# Altium project Flight_Computer_1.PrjPcb (part 2 of 2)

## Sheet Power.SchDoc
size B; SheetNumber: 4; SheetTotal: 7
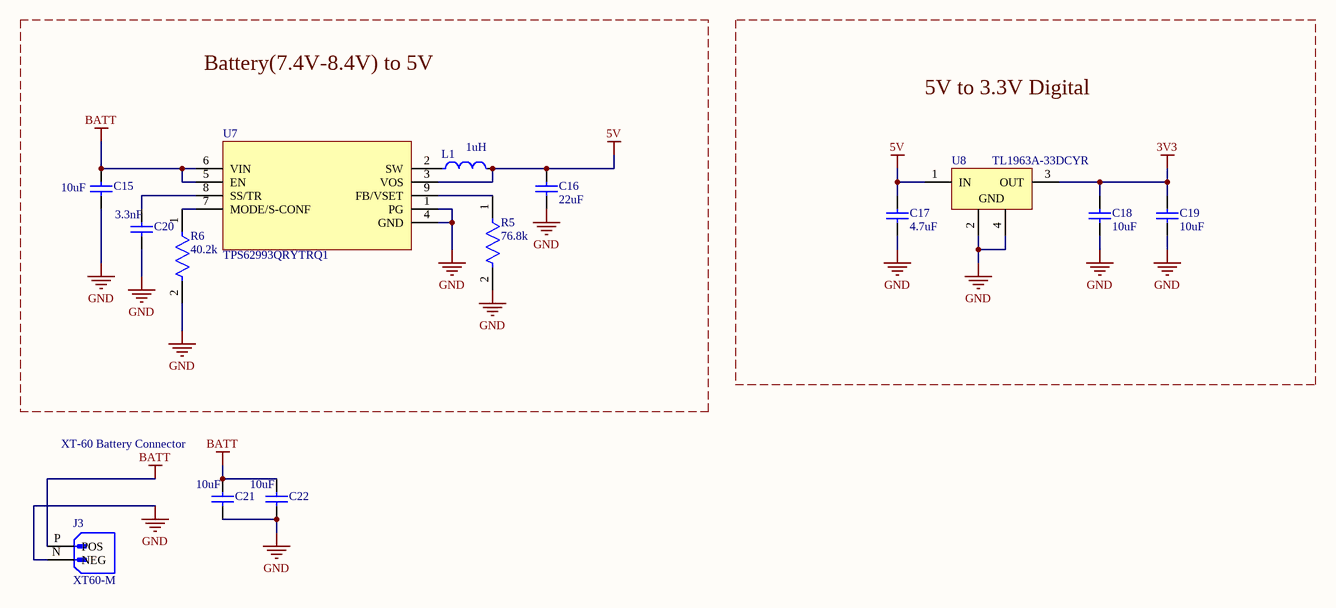
[diagram p1: Power.SchDoc]

### Parts
C15  10uF  [0402_C]
C16  22uF  [0402_C]
C17  4.7uF  [0402_C]
C18  10uF  [0402_C]
C19  10uF  [0402_C]
C20  3.3nF  [0402_C]
C21  10uF  [0402_C]
C22  10uF  [0402_C]
J3  XT60-M  [AMASS_XT60-M]
L1  1uH  [AOTAB201610S3R3101T]
R5  76.8k  [FP-RK73H1J-MFG]
R6  40.2k  [FP-RK73H1J-MFG]
U7  TPS62993QRYTRQ1  [RYT0009A-MFG]
U8  TL1963A-33DCYR  [SOT230P700X180-4N]

### Blocks framed on the sheet
Battery(7.4V-8.4V) to 5V: C15 C16 C20 L1 R5 R6 U7
5V to 3.3V Digital: C17-C19 U8

### Nets
3V3: C18.2 C19.2 U8.3(OUT)
5V: C16.2 C17.1 L1.2 U7.3(VOS) U8.1(IN)
BATT: C15.1 C21.1 C22.1 J3.P(POS) U7.5(EN) U7.6(VIN)
GND: C15.2 C16.1 C17.2 C18.1 C19.1 C20.1 C21.2 C22.2 J3.N(NEG) R5.2 R6.2 U7.1(PG) U7.4(GND) U8.2(GND) U8.4(GND)
NetC20_2: C20.2 U7.8(SS/TR)
NetL1_1: L1.1 U7.2(SW)
NetR5_1: R5.1 U7.9(FB/VSET)
NetR6_1: R6.1 U7.7(MODE/S-CONF)

### Notes on the sheet
- (near C21) XT-60 Battery Connector

### Library data of the parts
C15 C18 C19 C21 C22 = C_10uF_0402: Ceramic Capacitor, Multilayer, Ceramic, 10V, 20% +Tol, 20% -Tol, X5R, +-15% TC, 10uF, Surface Mount, 0402 inch; Manufacturer: Samsung Electro-Mechanics; Manufacturer Part Number: CL05A106MP5NUNC; Value: 10µF; LCSC Part #: C315248; Supplier: DigiKey; Supplier Part Number: 1276-1450-1-ND; RoHS: Compliant; Category: Ceramic Capacitors; Stock: 1973072; Pricing: 1=0.08, 10=0.038, 50=0.034, 100=0.0296, 500=0.0272, 1000=0.02, 2500=0.01844 (USD); Case/Package: 0402; Case Code (Imperial): 0402; Case Code (Metric): 1005; China RoHS: Compliant; Contact Plating: Tin; Depth: 500µm; Dielectric: X5R; Dielectric Material: Ceramic; Height: 700µm; Lead Free: Lead Free; Length: 1mm; Lifecycle Status: NRND; Material: Ceramic; Max Operating Temperature: 85°C; Min Operating Temperature: -55°C; Mounting Technology: Surface Mount; Number of Terminals: 2; Packaging: Tape and Reel; Radiation Hardening: No; REACH SVHC: Yes; Schedule B: 8532240020, 8532240020|8532240020|8532240020|8532240020|8532240020|8532240020|8532240020|8532240020|8532240020|8532240020|8532240020|8532240020|8532240020|8532240020|8532240020|8532240020|8532240020|8532240020|8532240020|8532240020|8532240020|8532240020|8532240020|85; Termination: Wraparound; Thickness: 711.2µm; Tolerance: 20%; Voltage Rating: 10V; Voltage Rating (DC): 10V; Width: 500µm; ComponentLink1URL: https://datasheet.octopart.com:443/CL05A106MP5NUNC-Samsung-Electro-Mechanics-datasheet-182018593.pdf?src-supplier=IHS; ComponentLink1Description: https://datasheet.octopart.com:443/CL05A106MP5NUNC-Samsung-Electro-Mechanics-datasheet-182018593.pdf?src-supplier=IHS; ComponentLink2URL: https://datasheet.octopart.com:443/CL05A106MP5NUNC-Samsung-Electro-Mechanics-datasheet-136031723.pdf?src-supplier=Upverter; ComponentLink2Description: https://datasheet.octopart.com:443/CL05A106MP5NUNC-Samsung-Electro-Mechanics-datasheet-136031723.pdf?src-supplier=Upverter; ComponentLink3URL: https://datasheet.octopart.com:443/CL05A106MP5NUNC-Samsung-Electro-Mechanics-datasheet-110226206.pdf?src-supplier=Future+Electronics; ComponentLink3Description: https://datasheet.octopart.com:443/CL05A106MP5NUNC-Samsung-Electro-Mechanics-datasheet-110226206.pdf?src-supplier=Future+Electronics; ComponentLink4URL: https://datasheet.octopart.com:443/CL05A106MP5NUNC-Samsung-Electro-Mechanics-datasheet-87580039.pdf?src-supplier=Future+Electronics; ComponentLink4Description: https://datasheet.octopart.com:443/CL05A106MP5NUNC-Samsung-Electro-Mechanics-datasheet-87580039.pdf?src-supplier=Future+Electronics; ComponentLink5URL: https://datasheet.octopart.com:443/CL05A106MP5NUNC-Samsung-Electro-Mechanics-datasheet-81461595.pdf?src-supplier=Future+Electronics; ComponentLink5Description: https://datasheet.octopart.com:443/CL05A106MP5NUNC-Samsung-Electro-Mechanics-datasheet-81461595.pdf?src-supplier=Future+Electronics; ComponentLink6URL: https://datasheet.octopart.com:443/CL05A106MP5NUNC-Samsung-datasheet-42280527.pdf?src-supplier=Future+Electronics; ComponentLink6Description: https://datasheet.octopart.com:443/CL05A106MP5NUNC-Samsung-datasheet-42280527.pdf?src-supplier=Future+Electronics; ComponentLink7URL: https://datasheet.octopart.com:443/CL05A106MP5NUNC-Samsung-datasheet-34153002.pdf?src-supplier=Future+Electronics; ComponentLink7Description: https://datasheet.octopart.com:443/CL05A106MP5NUNC-Samsung-datasheet-34153002.pdf?src-supplier=Future+Electronics; ComponentLink8URL: https://datasheet.octopart.com:443/CL05A106MP5NUNC-Samsung-datasheet-25077983.pdf?src-supplier=Future+Electronics; ComponentLink8Description: https://datasheet.octopart.com:443/CL05A106MP5NUNC-Samsung-datasheet-25077983.pdf?src-supplier=Future+Electronics; ComponentLink9URL: https://datasheet.octopart.com:443/CL05A106MP5NUNC-Samsung-Electro-Mechanics-datasheet-149136670.pdf?src-supplier=Future+Electronics; ComponentLink9Description: https://datasheet.octopart.com:443/CL05A106MP5NUNC-Samsung-Electro-Mechanics-datasheet-149136670.pdf?src-supplier=Future+Electronics; ComponentLink10URL: https://datasheet.octopart.com:443/CL05A106MP5NUNC-Samsung-datasheet-8326407.pdf?src-supplier=TME; ComponentLink10Description: https://datasheet.octopart.com:443/CL05A106MP5NUNC-Samsung-datasheet-8326407.pdf?src-supplier=TME
C16 = C_22uF_0402_1: CAP CER 22UF 10V X5R 0402; Manufacturer: Murata; Manufacturer Part Number: GRM158R61A226ME15D; Manufacturer Lifecycle Status: IN PRODUCTION; Value: 22µF; Dielectric Material: Ceramic; Tolerance: 20%; Supplier: DigiKey; Supplier Part Number: 490-GRM158R61A226ME15DCT-ND; RoHS: Compliant; Category: Ceramic Capacitors; Stock: 154156; Pricing: 1=0.41, 10=0.247, 50=0.1828, 100=0.1632, 500=0.1301, 1000=0.1199, 2500=0.10912, 8000=0.09979, 16000=0.09611, 24000=0.09372, 40000=0.09107, 56000=0.09089, 80000=0.08732 (USD); Case/Package: 0402; Dielectric: X5R; Height: 800µm; Length: 1mm; Lifecycle Status: Production; Material: Ceramic; Max Operating Temperature: 85°C; Min Operating Temperature: -55°C; Mounting Technology: Surface Mount; Number of Terminals: 2; REACH SVHC: Yes; Thickness: 800µm; Voltage Rating: 10V; Voltage Rating (DC): 10V; Width: 500µm; ComponentLink1URL: https://datasheet.octopart.com:443/GRM158R61A226ME15D-Murata-datasheet-165579666.pdf?src-supplier=TME; ComponentLink1Description: https://datasheet.octopart.com:443/GRM158R61A226ME15D-Murata-datasheet-165579666.pdf?src-supplier=TME; ComponentLink2URL: https://datasheet.octopart.com/GRM158R61A226ME15D-Murata-datasheet-12515295.pdf; ComponentLink2Description: https://datasheet.octopart.com/GRM158R61A226ME15D-Murata-datasheet-12515295.pdf; ComponentLink3URL: https://datasheet.octopart.com/GRM158R61A226ME15D-Murata-datasheet-12510076.pdf; ComponentLink3Description: https://datasheet.octopart.com/GRM158R61A226ME15D-Murata-datasheet-12510076.pdf; ComponentLink4URL: https://datasheet.octopart.com/GRM158R61A226ME15D-Murata-datasheet-11978611.pdf; ComponentLink4Description: https://datasheet.octopart.com/GRM158R61A226ME15D-Murata-datasheet-11978611.pdf; ComponentLink5URL: https://datasheet.octopart.com/GRM158R61A226ME15D-Murata-datasheet-10025737.pdf; ComponentLink5Description: https://datasheet.octopart.com/GRM158R61A226ME15D-Murata-datasheet-10025737.pdf; ComponentLink6URL: https://datasheet.octopart.com/GRM158R61A226ME15D-Murata-datasheet-8819587.pdf; ComponentLink6Description: https://datasheet.octopart.com/GRM158R61A226ME15D-Murata-datasheet-8819587.pdf; ComponentLink7URL: http://sigma.octopart.com:80/reach_statement/Murata-company-16.pdf?src-supplier=Compliance+Statements; ComponentLink7Description: http://sigma.octopart.com:80/reach_statement/Murata-company-16.pdf?src-supplier=Compliance+Statements; LCSC Part #: C3845593
C17 = C_4.7uF_0402: CAP CER 4.7UF 16V X5R 0402; Manufacturer: Samsung; Manufacturer Part Number: CL05A475MO5NUNC; Dielectric Material: Ceramic; Multilayer: Yes; Tolerance  (fill in as +-): 20%; Supplier: Digikey; Supplier Part Number: 1276-6836-1-ND; RoHS: Yes; Category: Ceramic Capacitors; Stock: 200989; Pricing: 1=0.43, 10=0.252, 50=0.1826, 100=0.161, 500=0.12446, 1000=0.11305, 2500=0.10094, 5000=0.0936, 10000=0.08752, 20000=0.08248, 30000=0.07994, 50000=0.07712, 70000=0.07547, 100000=0.07387 (USD); Mounting Technology: Surface Mount; Pins: 2; Package Shape: Rectangular; Case/Package: 0402; Terminal Finish: Nickel; Min Operating Temperature: -55°C; Max Operating Temperature: 85°C; JESD-609 Code: e3; Value: 4.7uF; Capacitor Type: Ceramic; Package Style: SMTMeter; Packaging: Tape and Reel; Tolerance (fill in as +-): 20%; Rated DC Voltage (URdc): 16V; Temperature Characteristics Code: X5R; Termination: Wraparound; Length: 1mm; Width: 0.5mm; Height: 0.7mm; Reach SVHC Compliant: Yes; RoHS Compliant: Yes; ComponentLink1URL: https://datasheet.ciiva.com:443/pdfs/VipMasterIC/IC/SEMS/SEMS-S-A0008384515/SEMS-S-A0008898881-1.pdf?src-supplier=IHS+Markit; ComponentLink1Description: https://datasheet.ciiva.com:443/pdfs/VipMasterIC/IC/SEMS/SEMS-S-A0008384515/SEMS-S-A0008898881-1.pdf?src-supplier=IHS+Markit; ComponentLink2URL: http://www.farnell.com/datasheets/2710653.pdf?src-supplier=Farnell; ComponentLink2Description: http://www.farnell.com/datasheets/2710653.pdf?src-supplier=Farnell; ComponentLink3URL: http://www.samsungsem.com/kr/support/product-search/mlcc/CL05A475MO5NUNC.jsp?src-supplier=Digikey; ComponentLink3Description: http://www.samsungsem.com/kr/support/product-search/mlcc/CL05A475MO5NUNC.jsp?src-supplier=Digikey; ComponentLink4URL: http://www.farnell.com/datasheets/2710653.pdf?src-supplier=Newark; ComponentLink4Description: http://www.farnell.com/datasheets/2710653.pdf?src-supplier=Newark; ComponentLink5URL: http://www.farnell.com/datasheets/2710653.pdf?src-supplier=Element14; ComponentLink5Description: http://www.farnell.com/datasheets/2710653.pdf?src-supplier=Element14; ComponentLink6URL: https://datasheet.octopart.com/CL05A475MO5NUNC-Samsung-Electro-Mechanics-datasheet-123102911.pdf?src-supplier=Future+Electronics; ComponentLink6Description: https://datasheet.octopart.com/CL05A475MO5NUNC-Samsung-Electro-Mechanics-datasheet-123102911.pdf?src-supplier=Future+Electronics; LCSC Part #: C318563
C20 = C_3.3nF_0402: CAP CER 3300PF (3.3nF) 10V X7R 0402; Manufacturer: Samsung Electro-Mechanics; Manufacturer Part Number: CL05B332KA5VPNC; Dielectric Material: Ceramic; Tolerance: 10%; Voltage Rating: 25V; Supplier: DigiKey; Supplier Part Number: 1276-CL05B332KA5VPNCCT-ND; RoHS: Compliant; Category: Ceramic Capacitors; Stock: 24876; Pricing: 1=0.1, 10=0.034, 50=0.0226, 100=0.0193, 500=0.0138, 1000=0.01212, 2500=0.01034, 5000=0.00928 (USD); Value: 3.3nF; Case/Package: 0402; China RoHS: Compliant; Height: 500µm; Length: 1mm; Lifecycle Status: Production; Material: Ceramic; Max Operating Temperature: 125°C; Min Operating Temperature: -55°C; Mounting Technology: Surface Mount; Number of Terminals: 2; REACH SVHC: Yes; Voltage Rating (DC): 25V; Width: 500µm; ComponentLink1URL: https://datasheet.octopart.com:443/CL05B332KA5VPNC-Samsung-Electro-Mechanics-datasheet-176142735.pdf?src-supplier=IHS; ComponentLink1Description: https://datasheet.octopart.com:443/CL05B332KA5VPNC-Samsung-Electro-Mechanics-datasheet-176142735.pdf?src-supplier=IHS; Case Code (Imperial): 0402; Case Code (Metric): 1005; Dielectric: X7R; Pins: 2; Termination: SMD/SMT; Weight: 652.039032µg; ComponentLink2URL: https://datasheet.octopart.com:443/C0402C332M8RACTU-KEMET-datasheet-178445679.pdf?src-supplier=IHS; ComponentLink2Description: https://datasheet.octopart.com:443/C0402C332M8RACTU-KEMET-datasheet-178445679.pdf?src-supplier=IHS; ComponentLink3URL: https://datasheet.octopart.com:443/C0402C332M8RACTU-KEMET-datasheet-137357759.pdf?src-supplier=Upverter; ComponentLink3Description: https://datasheet.octopart.com:443/C0402C332M8RACTU-KEMET-datasheet-137357759.pdf?src-supplier=Upverter; ComponentLink4URL: https://datasheet.octopart.com:443/C0402C332M8RACTU-KEMET-datasheet-157246124.pdf?src-supplier=Electro+Sonic; ComponentLink4Description: https://datasheet.octopart.com:443/C0402C332M8RACTU-KEMET-datasheet-157246124.pdf?src-supplier=Electro+Sonic; ComponentLink5URL: https://datasheet.octopart.com/C0402C332M8RACTU-KEMET-datasheet-84169754.pdf; ComponentLink5Description: https://datasheet.octopart.com/C0402C332M8RACTU-KEMET-datasheet-84169754.pdf; LCSC Part #: C20793063
J3 = CMP-036-000000-1: Plug; DC supply; XT60; male; PIN: 2; for cable; soldered; 30A; 500V; MF: AMASS; Design Item ID: XT60-M; Component Type: Standard; Package: Package; Pin Count: 2; SnapEDA_Link: https://www.snapeda.com/parts/XT60-M/AMASS/view-part/?ref=snap; Value: *; MP: XT60-M; Source: XT60-M.SchLib; Check_prices: https://www.snapeda.com/parts/XT60-M/AMASS/view-part/?ref=eda
L1 = L_1uH_2016: FIXED IND 1UH 1.7A 128 MOHM SMD; Manufacturer: Murata; Manufacturer Part Number: DFE201610E-2R2M=P2; Manufacturer Lifecycle Status: IN PRODUCTION; DC Resistance (DCR): 140mΩ; Value: 2.2µH; Inductance Tolerance: 20%; Number of Circuits: 1; Saturation Current: 2.4A; Shielding: Yes; Test Frequency: 1MHz; Core Material: Metal; Supplier: DigiKey; Supplier Part Number: 490-17728-1-ND; RoHS: Compliant; Category: Fixed Inductors; Stock: 158333; Pricing: 1=0.24, 10=0.2, 100=0.1645, 1000=0.13528 (USD); Case/Package: 0806; Composition: Wirewound; Current Rating: 1.7A; Height: 1mm; Lifecycle Status: Production; Max Current Rating: 1.7A; Max Operating Temperature: 125°C; Min Operating Temperature: -40°C; Number of Terminals: 2; Packaging: Cut Tape; REACH SVHC: Yes; RMS Current (Irms): 1.7A; Schedule B: 8504500000; ESR: 140mΩ; Tolerance: 20%; Width: 1.6mm; Ambient Temperature Range High: 85°C; ComponentLink1URL: https://datasheet.octopart.com:443/DFE18SAN1R0MG0L-Murata-datasheet-141261288.pdf?src-supplier=Ciiva; ComponentLink1Description: https://datasheet.octopart.com:443/DFE18SAN1R0MG0L-Murata-datasheet-141261288.pdf?src-supplier=Ciiva; ComponentLink2URL: https://datasheet.octopart.com:443/DFE18SAN1R0MG0L-Murata-datasheet-140650244.pdf?src-supplier=Ciiva; ComponentLink2Description: https://datasheet.octopart.com:443/DFE18SAN1R0MG0L-Murata-datasheet-140650244.pdf?src-supplier=Ciiva; ComponentLink3URL: https://datasheet.octopart.com:443/DFE18SAN1R0MG0L-Murata-datasheet-138707311.pdf?src-supplier=Ciiva; ComponentLink3Description: https://datasheet.octopart.com:443/DFE18SAN1R0MG0L-Murata-datasheet-138707311.pdf?src-supplier=Ciiva; ComponentLink4URL: https://datasheet.octopart.com:443/DFE18SAN1R0MG0L-Murata-datasheet-140568518.pdf?src-supplier=Arrow.cn; ComponentLink4Description: https://datasheet.octopart.com:443/DFE18SAN1R0MG0L-Murata-datasheet-140568518.pdf?src-supplier=Arrow.cn; ComponentLink5URL: https://datasheet.octopart.com:443/DFE18SAN1R0MG0L-Murata-datasheet-169352396.pdf?src-supplier=Arrow.cn; ComponentLink5Description: https://datasheet.octopart.com:443/DFE18SAN1R0MG0L-Murata-datasheet-169352396.pdf?src-supplier=Arrow.cn; ComponentLink6URL: https://datasheet.octopart.com:443/DFE18SAN1R0MG0L-Murata-datasheet-145448863.pdf?src-supplier=Geoflip; ComponentLink6Description: https://datasheet.octopart.com:443/DFE18SAN1R0MG0L-Murata-datasheet-145448863.pdf?src-supplier=Geoflip; ComponentLink7URL: http://sigma.octopart.com:80/reach_statement/Murata-company-16.pdf?src-supplier=Compliance+Statements; ComponentLink7Description: http://sigma.octopart.com:80/reach_statement/Murata-company-16.pdf?src-supplier=Compliance+Statements; LCSC Part #: C560043
R5 R6 = CMP-04015-087673-1: 40.2kΩ ±0.5% 0.1W Chip Resistor 0603 Thick Film AEC-Q200 Qualified / RK73H1JTTD4022D; Resistance: 40.2kR; Temperature Coefficient: 100ppm/°C; Voltage Rating (DC): 50V; Power Rating: 100mW; Length: 1.6mm; Width: 0.8mm; Series: RK73H; Case Code (Imperial): 0603; Min Operating Temperature: -55°C; Height: 0.45mm; Packaging: Tape and Reel; Case/Package: 0603; Max Operating Temperature: 155°C; Tolerance: 0.5%; Voltage Rating: 50V; Package Quantity: 5000; Lead Free: Lead Free; Case Code (Metric): 1608; Termination: SMD/SMT
U7 = TPS62993QRYTRQ1: IC REG BUCK ADJ 3A 9VQFN; Manufacturer: Texas Instruments; Supplier: Digikey; Supplier Part Number: 296-TPS62993QRYTRQ1CT-ND; Manufacturer Part Number: TPS62993QRYTRQ1; RoHS: No; Category: Integrated Circuits (ICs); Stock: 5849; Pricing: 1=1.93, 10=1.418, 25=1.2916, 100=1.1519, 250=1.0854, 500=1.0453, 1000=1.01229 (USD); LCSC Part #: C5342042
U8 = TL1963A-33DCYR: 1.5-A, 20-V, low-dropout voltage regulator with reverse current & reverse voltage protection; Manufacturer_Name: Texas Instruments; Manufacturer Lifecycle Status: ACTIVE; Accuracy: 3%; Dropout Voltage: 340mV; Input Bias Current: 1mA; Max Supply Voltage: 20V; Max Output current: 1.5A; Max Output Voltage: 3.3V; Min Current Limit: 1.6A; Min Input Voltage: 2.1V; Number of Outputs: 1; Output Type: Fixed; Polarity: Positive; Datasheet Link: http://www.ti.com/lit/gpn/tl1963a; Height: 1.8mm; Manufacturer_Part_Number: TL1963A-33DCYR; Mouser Part Number: 595-TL1963A-33DCYR; Mouser Price/Stock: https://www.mouser.co.uk/ProductDetail/Texas-Instruments/TL1963A-33DCYR?qs=IK5e5L0zOXhRu%2FNTAfJNEA%3D%3D; Arrow Part Number: TL1963A-33DCYR; Arrow Price/Stock: https://www.arrow.com/en/products/tl1963a-33dcyr/texas-instruments?utm_currency=USD&region=nac; Supplier: DigiKey; Supplier Part Number: 296-24897-1-ND; Manufacturer: Texas Instruments; Manufacturer Part Number: TL1963A-33DCYR; RoHS: Compliant; Category: LDO Voltage Regulators; Stock: 4355; Pricing: 1=3.13, 10=2.344, 25=2.1476, 100=1.9323, 250=1.82956, 500=1.76766, 1000=1.71669 (USD); Case/Package: SOT-223; Contact Plating: Tin; Lead Free: Lead Free; Length: 6.5mm; Lifecycle Status: Production; Max Operating Temperature: 125°C; Min Operating Temperature: -40°C; Min Output Voltage: 3.3V; Nominal Output Voltage: 3.3V; Pins: 4; Number of Regulators: 1; Output Current: 1.5A; Output Voltage: 3.3V; Quiescent Current: 1mA; Radiation Hardening: No; REACH SVHC: No; Schedule B: 8542390000, 8542390000|8542390000|8542390000|8542390000|8542390000; Thickness: 1.6mm; Width: 3.5mm; ComponentLink1URL: https://datasheet.octopart.com:443/TL1963A-33DCYR-Texas-Instruments-datasheet-36835243.pdf?src-supplier=Texas+Instruments; ComponentLink1Description: https://datasheet.octopart.com:443/TL1963A-33DCYR-Texas-Instruments-datasheet-36835243.pdf?src-supplier=Texas+Instruments; ComponentLink2URL: https://octopart.com:443/opatz8j6/c1?t=3Lun9PgwTMhtjoCtZHlriymffnwWqKd51HlxjKqmfGY6_H2C_KBuCJotYNbhgrmUW1am7v6JdR1BM8r4TVwEJHz6z_rYMi0Qs0z031CNxm_B_9-BYGGxZ_Fe_No2pK5gm8TBALu2o229stvTAGB7nDQj_d6eLc_WleCR5PgeZcoHvq5uYRxI2mhH3aTbYxZvOcpV44gzguOSokgnxqAqTlA2HdDmfd41lcX8KmPOnU485MJM9pETPtWF01ZaQY57NDW7-ROrD2Y9bItpv_3any2aMifmmrhF_toBthhzSyuf2zhFnIbHnl95_iEcXCGpEhG0L2gK6G5uW0d_9rjbvPyTU-a0lHmUSU5HzPKTGuVJR0-dcjYtdbWCQCILPtH1cCuZdAY&src-supplier=Texas+Instruments; ComponentLink2Description: https://octopart.com:443/opatz8j6/c1?t=3Lun9PgwTMhtjoCtZHlriymffnwWqKd51HlxjKqmfGY6_H2C_KBuCJotYNbhgrmUW1am7v6JdR1BM8r4TVwEJHz6z_rYMi0Qs0z031CNxm_B_9-BYGGxZ_Fe_No2pK5gm8TBALu2o229stvTAGB7nDQj_d6eLc_WleCR5PgeZcoHvq5uYRxI2mhH3aTbYxZvOcpV44gzguOSokgnxqAqTlA2HdDmfd41lcX8KmPOnU485MJM9pETPtWF01ZaQY57NDW7-ROrD2Y9bItpv_3any2aMifmmrhF_toBthhzSyuf2zhFnIbHnl95_iEcXCGpEhG0L2gK6G5uW0d_9rjbvPyTU-a0lHmUSU5HzPKTGuVJR0-dcjYtdbWCQCILPtH1cCuZdAY&src-supplier=Texas+Instruments; ComponentLink3URL: https://datasheet.octopart.com:443/TL1963A-33DCYR-Texas-Instruments-datasheet-10255270.pdf?src-supplier=Texas+Instruments; ComponentLink3Description: https://datasheet.octopart.com:443/TL1963A-33DCYR-Texas-Instruments-datasheet-10255270.pdf?src-supplier=Texas+Instruments; ComponentLink4URL: https://sigma.octopart.com:443/49253063/technical_drawing/Texas-Instruments-TL1963A-33DCYR.pdf?src-supplier=Texas+Instruments; ComponentLink4Description: https://sigma.octopart.com:443/49253063/technical_drawing/Texas-Instruments-TL1963A-33DCYR.pdf?src-supplier=Texas+Instruments; ComponentLink5URL: https://datasheet.octopart.com:443/TL1963A-33DCYR-Texas-Instruments-datasheet-159117591.pdf?src-supplier=Augswan; ComponentLink5Description: https://datasheet.octopart.com:443/TL1963A-33DCYR-Texas-Instruments-datasheet-159117591.pdf?src-supplier=Augswan; ComponentLink6URL: https://datasheet.octopart.com:443/TL1963A-33DCYR-Texas-Instruments-datasheet-21820479.pdf?src-supplier=Newark; ComponentLink6Description: https://datasheet.octopart.com:443/TL1963A-33DCYR-Texas-Instruments-datasheet-21820479.pdf?src-supplier=Newark; ComponentLink7URL: https://datasheet.octopart.com:443/TL1963A-33DCYR-Texas-Instruments-datasheet-16079880.pdf?src-supplier=Farnell; ComponentLink7Description: https://datasheet.octopart.com:443/TL1963A-33DCYR-Texas-Instruments-datasheet-16079880.pdf?src-supplier=Farnell; ComponentLink8URL: https://datasheet.octopart.com:443/TL1963A-33DCYR-Texas-Instruments-datasheet-14171511.pdf?src-supplier=iiiC; ComponentLink8Description: https://datasheet.octopart.com:443/TL1963A-33DCYR-Texas-Instruments-datasheet-14171511.pdf?src-supplier=iiiC; ComponentLink9URL: http://sigma.octopart.com:80/conflict_mineral_statement/Texas-Instruments-company-63.pdf?src-supplier=Compliance+Statements; ComponentLink9Description: http://sigma.octopart.com:80/conflict_mineral_statement/Texas-Instruments-company-63.pdf?src-supplier=Compliance+Statements; ComponentLink10URL: http://sigma.octopart.com:80/reach_statement/Texas-Instruments-company-64.pdf?src-supplier=Compliance+Statements; ComponentLink10Description: http://sigma.octopart.com:80/reach_statement/Texas-Instruments-company-64.pdf?src-supplier=Compliance+Statements; LCSC Part #: C181262

## Sheet Connector.SchDoc
size A; SheetNumber: 6; SheetTotal: 7
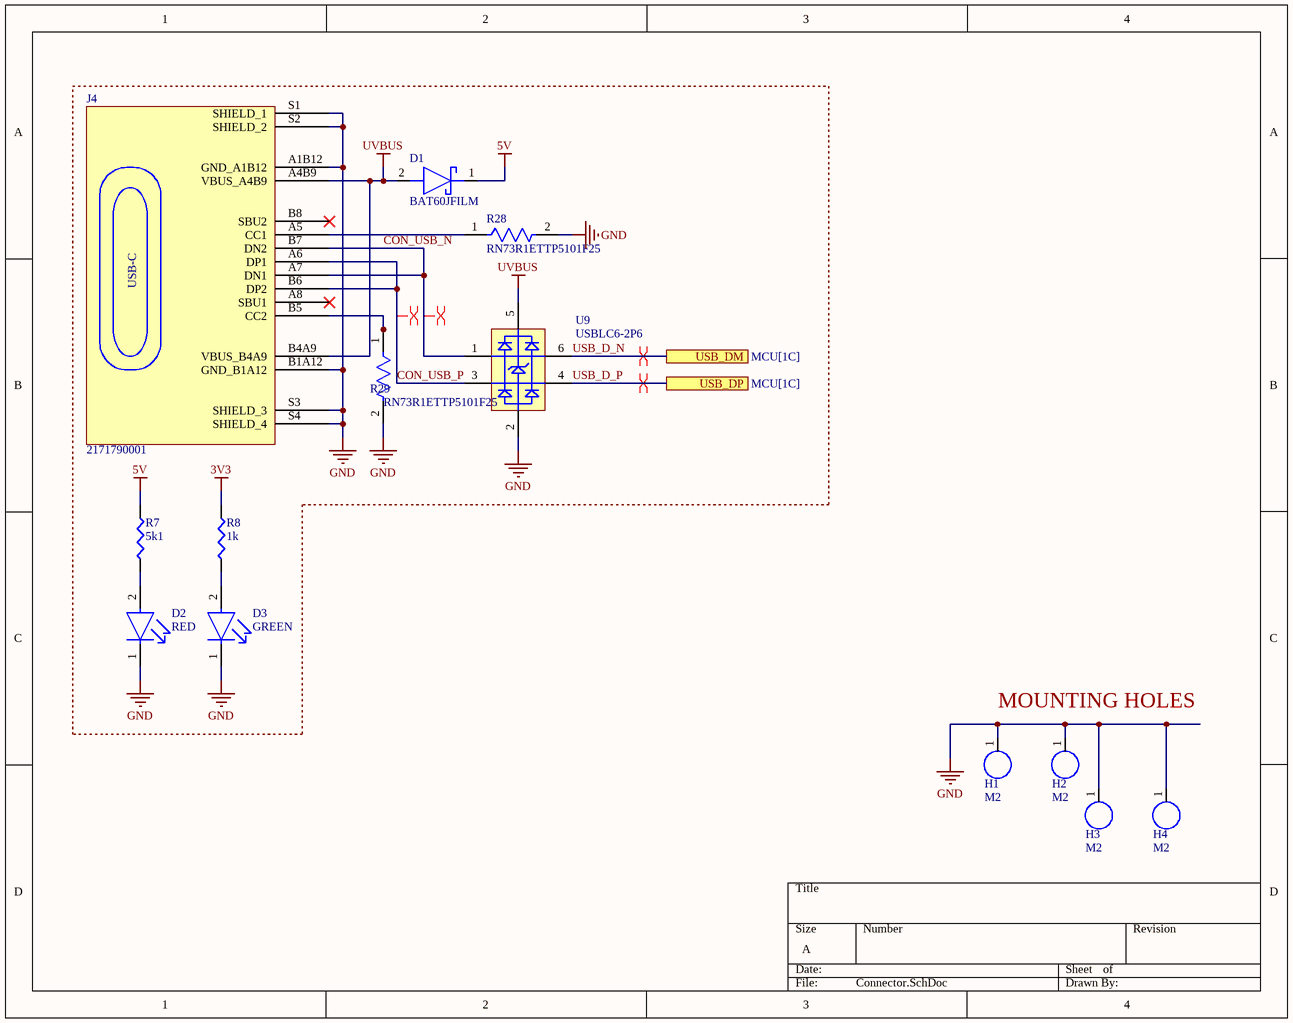
[diagram p2: Connector.SchDoc]

### Parts
D1  BAT60JFILM  [SOD2513X117N]
D2  RED  [LEDC1005X35N]
D3  GREEN  [LEDC1005X35N]
H1  M2  [Mounting Hole]
H2  M2  [Mounting Hole]
H3  M2  [Mounting Hole]
H4  M2  [Mounting Hole]
J4  2171790001  [FP-2171790001-MFG]
R7  5k1  [0402_R]
R8  1k  [0402_R]
R28  RN73R1ETTP5101F25  [FP-RN73R1E-IPC_C]
R29  RN73R1ETTP5101F25  [FP-RN73R1E-IPC_C]
U9  USBLC6-2P6  [USBLC62P6]

### Ports
USB_DM (see MCU[1C]), USB_DP (see MCU[1C])

### Nets
3V3: R8.2
5V: D1.1(K) R7.2
GND: D2.1(C) D3.1(C) H1.1 H2.1 H3.1 H4.1 J4.A1B12(GND_A1B12) J4.B1A12(GND_B1A12) J4.S1(SHIELD_1) J4.S2(SHIELD_2) J4.S3(SHIELD_3) J4.S4(SHIELD_4) R28.2 R29.2 U9.2(GND)
UVBUS: D1.2(A) J4.A4B9(VBUS_A4B9) J4.B4A9(VBUS_B4A9) U9.5(VBUS)
CON_USB_N: J4.A7(DN1) J4.B7(DN2) U9.1(I/O1_1)
CON_USB_P: J4.A6(DP1) J4.B6(DP2) U9.3(I/O2_1)
USB_D_N: U9.6(I/O1_2) ; port USB_DM
USB_D_P: U9.4(I/O2_2) ; port USB_DP
NetD2_2: D2.2(A) R7.1
NetD3_2: D3.2(A) R8.1
NetJ4_A5: J4.A5(CC1) R28.1
NetJ4_B5: J4.B5(CC2) R29.1

Not connected (* = marked no-connect by the designer): J4 A8(SBU1)* B8(SBU2)*

### Layout directives
differential pair; differential pair class DIFF 90: CON_USB_N, CON_USB_P
differential pair; differential pair class DIFF90: USB_D_N, USB_D_P

### Notes on the sheet
- MOUNTING HOLES
- (in symbol 217179-0001) USB-C

### Library data of the parts
D1 = D_Schotty_Diode: Diode Small Signal Schottky 10V 3A Automotive 2-Pin SOD-323 T/R; Manufacturer: STMicroelectronics; Element Configuration: Single; Forward Voltage: 320mV; Max Forward Surge Current (Ifsm): 5A; Max Junction Temperature (Tj): 150°C; Max Power Dissipation: 310mW; Max Reverse Leakage Current: 7.5µA; Number of Elements: 1; Peak Reverse Current: 2.5µA; Polarity: Standard; Supplier: DigiKey; Supplier Part Number: 497-3707-1-ND; Manufacturer Part Number: BAT60JFILM; RoHS: Compliant; Category: Schottky Diodes; Stock: 96297; Pricing: 1=0.29, 10=0.14, 100=0.1213, 500=0.08962, 1000=0.07938 (USD); Average Rectified Current: 3A; China RoHS: Compliant; Contact Plating: Tin; Current Rating: 3A; Forward Current: 3A; Height: 1.17mm; Lead Free: Lead Free; Length: 1.8mm; Lifecycle Status: Production; Max Operating Temperature: 150°C; Max Output current: 3A; Max Repetitive Reverse Voltage (Vrrm): 10V; Max Reverse Voltage (DC): 10V; Max Surge Current: 5A; Min Operating Temperature: -65°C; Mounting Technology: Surface Mount; Pins: 2; Number of Terminals: 2; Output Current: 3A; Packaging: Tape and Reel; Peak Non-Repetitive Surge Current: 5A; Radiation Hardening: No; REACH SVHC: Yes; Reverse Standoff Voltage: 10V; Schedule B: 8541100080, 8541100080|8541100080|8541100080|8541100080|8541100080|8541100080|8541100080|8541100080|8541100080|8541100080|8541100080|8541100080|8541100080|8541100080|8541100080|8541100080|8541100080|8541100080|8541100080|8541100080|8541100080|8541100080|8541100080|85; Voltage Rating (DC): 10V; Weight: 4.535924g; Width: 1.45mm; ComponentLink1URL: https://datasheet.octopart.com:443/BAT60JFILM-STMicroelectronics-datasheet-56177.pdf?src-supplier=STMicroelectronics; ComponentLink1Description: https://datasheet.octopart.com:443/BAT60JFILM-STMicroelectronics-datasheet-56177.pdf?src-supplier=STMicroelectronics; ComponentLink2URL: https://datasheet.octopart.com:443/BAT60JFILM-STMicroelectronics-datasheet-12532682.pdf?src-supplier=TME; ComponentLink2Description: https://datasheet.octopart.com:443/BAT60JFILM-STMicroelectronics-datasheet-12532682.pdf?src-supplier=TME; ComponentLink3URL: https://datasheet.octopart.com:443/BAT60JFILM-STMicroelectronics-datasheet-181242469.pdf?src-supplier=Newark; ComponentLink3Description: https://datasheet.octopart.com:443/BAT60JFILM-STMicroelectronics-datasheet-181242469.pdf?src-supplier=Newark; ComponentLink4URL: https://datasheet.octopart.com:443/BAT60JFILM-STMicroelectronics-datasheet-14054140.pdf?src-supplier=iiiC; ComponentLink4Description: https://datasheet.octopart.com:443/BAT60JFILM-STMicroelectronics-datasheet-14054140.pdf?src-supplier=iiiC; LCSC Part #: C133103
D2 = D_RED_LED: RED LED; LCSC Part #: C397045
D3 = D_GREEN_LED: Green LED; LCSC Part #: C434446
H1-H4 = M2 Mounting Hole: 2mm M2 Mounting Hole
J4 = 217179-0001: CONN RCP USB2.0 TYP C 24P SMD RA; Manufacturer: Molex; Supplier: Digikey; Supplier Part Number: 900-2171790001CT-ND; Manufacturer Part Number: 217179-0001; RoHS: No; Category: Connectors; Stock: 11294; Pricing: 1=0.98, 10=0.731, 25=0.6564, 50=0.6074, 100=0.5642, 250=0.51468, 500=0.48234, 1200=0.44689, 2400=0.42258, 3600=0.40973, 6000=0.39484, 8400=0.38577, 12000=0.37675 (USD); LCSC Part #: C3197684
R7 = R_5K1_0402: Res Thick Film 0402 5.1K Ohm 1% 0.063W(1/16W) ±100ppm/C Pad SMD T/R; Manufacturer: Yageo Group; Manufacturer Part Number: RC0402FR-135K1L; Power Dissipation: 62.5mW; Value: 5.1kΩ; Temperature Coefficient: 100ppm/°C; Voltage Rating: 50V; Supplier: DigiKey; Supplier Part Number: 13-RC0402FR-135K1LCT-ND; RoHS: Compliant; Category: Chip SMD Resistors; Stock: 220857; Pricing: 1=0.1, 10=0.005, 25=0.0044, 50=0.004, 100=0.0036, 250=0.00328 (USD); Case/Package: 0402; Case Code (Imperial): 0402; Case Code (Metric): 1005; China RoHS: Non-Compliant; Composition: Thick Film; Contact Plating: Tin; Height: 350µm; Length: 1mm; Lifecycle Status: Production; Max Operating Temperature: 155°C; Min Operating Temperature: -55°C; Mounting Technology: Surface Mount; Number of Terminals: 2; Packaging: Tape & Reel; Power Rating: 62.5mW; Radiation Hardening: No; REACH SVHC: Yes; Termination: SMD/SMT; Tolerance: 1%; Width: 500µm; Working Voltage: 50V; ComponentLink1URL: https://datasheet.octopart.com:443/RC0402FR-135K1L-Yageo-datasheet-175887523.pdf?src-supplier=IHS; ComponentLink1Description: https://datasheet.octopart.com:443/RC0402FR-135K1L-Yageo-datasheet-175887523.pdf?src-supplier=IHS; ComponentLink2URL: https://datasheet.octopart.com:443/RC0402FR-135K1L-Yageo-datasheet-164759695.pdf?src-supplier=Future+Electronics; ComponentLink2Description: https://datasheet.octopart.com:443/RC0402FR-135K1L-Yageo-datasheet-164759695.pdf?src-supplier=Future+Electronics; ComponentLink3URL: https://datasheet.octopart.com/RC0402FR-135K1L-Yageo-datasheet-73766026.pdf; ComponentLink3Description: https://datasheet.octopart.com/RC0402FR-135K1L-Yageo-datasheet-73766026.pdf; ComponentLink4URL: https://datasheet.octopart.com:443/RC0402FR-135K1L-Yageo-datasheet-10408619.pdf?src-supplier=_legacy+Avnet; ComponentLink4Description: https://datasheet.octopart.com:443/RC0402FR-135K1L-Yageo-datasheet-10408619.pdf?src-supplier=_legacy+Avnet; ComponentLink5URL: http://sigma.octopart.com:80/rohs_statement/Yageo-company-2.pdf?src-supplier=Compliance+Statements; ComponentLink5Description: http://sigma.octopart.com:80/rohs_statement/Yageo-company-2.pdf?src-supplier=Compliance+Statements; ComponentLink6URL: http://sigma.octopart.com:80/conflict_mineral_statement/Yageo-company-3.pdf?src-supplier=Compliance+Statements; ComponentLink6Description: http://sigma.octopart.com:80/conflict_mineral_statement/Yageo-company-3.pdf?src-supplier=Compliance+Statements; LCSC Part #: C4346772
R8 = R_1k_0402: RES 1K OHM 1% 1/16W 0402; Manufacturer: Yageo Group; Manufacturer Part Number: RC0402FR-071KL; Power Dissipation: 62.5mW; Power Rating: 63mW; Value: 1kΩ; Temperature Coefficient: 100ppm/°C; Voltage Rating: 50V; LCSC Part #: C106235; Supplier: DigiKey; Supplier Part Number: 311-1.00KLRTR-ND; RoHS: Compliant; Category: Chip SMD Resistors; Stock: 4926888; Pricing: 10000=0.00204, 20000=0.002, 30000=0.00196, 50000=0.00182, 70000=0.00181 (USD); Case/Package: 0402; Case Code (Imperial): 0402; Case Code (Metric): 0402; China RoHS: Non-Compliant; Composition: Thick Film; Depth: 500µm; Height: 350µm; Lead Free: Lead Free; Length: 1mm; Lifecycle Status: Production; Max Operating Temperature: 155°C; Military Standard: Not; Min Operating Temperature: -55°C; Mounting Technology: Surface Mount; Pins: 2; Number of Terminals: 2; Packaging: Tape & Reel; REACH SVHC: Yes; Schedule B: 8533210045, 8533210045|8533210045|8533210045|8533210045|8533210045|8533210045|8533210045|8533210045|8533210045|8533210045|8533210045|8533210045|8533210045|8533210045|8533210045|8533210045|8533210045|8533210045|8533210045|8533210045|8533210045|8533210045|8533210045|85; Termination: SMD/SMT; Tolerance: 1%; Voltage Rating (AC): 50V; Voltage Rating (DC): 50V; Width: 500µm; Working Voltage: 50V; ComponentLink1URL: https://datasheet.octopart.com:443/RC0402FR-071KL-Yageo-datasheet-175887523.pdf?src-supplier=IHS; ComponentLink1Description: https://datasheet.octopart.com:443/RC0402FR-071KL-Yageo-datasheet-175887523.pdf?src-supplier=IHS; ComponentLink2URL: https://datasheet.octopart.com:443/RC0402FR-071KL-Yageo-datasheet-164759695.pdf?src-supplier=Upverter; ComponentLink2Description: https://datasheet.octopart.com:443/RC0402FR-071KL-Yageo-datasheet-164759695.pdf?src-supplier=Upverter; ComponentLink3URL: https://datasheet.octopart.com:443/RC0402FR-071KL-Yageo-datasheet-103092701.pdf?src-supplier=Upverter; ComponentLink3Description: https://datasheet.octopart.com:443/RC0402FR-071KL-Yageo-datasheet-103092701.pdf?src-supplier=Upverter; ComponentLink4URL: https://sigma.octopart.com:443/138820526/technical_drawing/Yageo-RC0402FR-071KL.pdf?src-supplier=Upverter; ComponentLink4Description: https://sigma.octopart.com:443/138820526/technical_drawing/Yageo-RC0402FR-071KL.pdf?src-supplier=Upverter; ComponentLink5URL: https://datasheet.octopart.com:443/RC0402FR-071KL-Yageo-datasheet-98239111.pdf?src-supplier=Upverter; ComponentLink5Description: https://datasheet.octopart.com:443/RC0402FR-071KL-Yageo-datasheet-98239111.pdf?src-supplier=Upverter; ComponentLink6URL: https://datasheet.octopart.com:443/RC0402FR-071KL-Yageo-datasheet-10408619.pdf?src-supplier=Newark; ComponentLink6Description: https://datasheet.octopart.com:443/RC0402FR-071KL-Yageo-datasheet-10408619.pdf?src-supplier=Newark; ComponentLink7URL: https://datasheet.octopart.com:443/RC0402FR-071KL-Yageo-datasheet-8324527.pdf?src-supplier=Newark; ComponentLink7Description: https://datasheet.octopart.com:443/RC0402FR-071KL-Yageo-datasheet-8324527.pdf?src-supplier=Newark; ComponentLink8URL: https://datasheet.octopart.com:443/RC0402FR-071KL-Yageo-datasheet-62067350.pdf?src-supplier=Farnell; ComponentLink8Description: https://datasheet.octopart.com:443/RC0402FR-071KL-Yageo-datasheet-62067350.pdf?src-supplier=Farnell; ComponentLink9URL: https://datasheet.octopart.com:443/RC0402FR-071KL-Yageo-datasheet-12531192.pdf?src-supplier=Future+Electronics; ComponentLink9Description: https://datasheet.octopart.com:443/RC0402FR-071KL-Yageo-datasheet-12531192.pdf?src-supplier=Future+Electronics; ComponentLink10URL: https://datasheet.octopart.com:443/RC0402FR-071KL-Yageo-datasheet-137700087.pdf?src-supplier=Future+Electronics; ComponentLink10Description: https://datasheet.octopart.com:443/RC0402FR-071KL-Yageo-datasheet-137700087.pdf?src-supplier=Future+Electronics; ComponentLink11URL: https://datasheet.octopart.com:443/RC0402FR-071KL-Yageo-datasheet-8324255.pdf?src-supplier=Future+Electronics; ComponentLink11Description: https://datasheet.octopart.com:443/RC0402FR-071KL-Yageo-datasheet-8324255.pdf?src-supplier=Future+Electronics; ComponentLink12URL: https://datasheet.octopart.com:443/RC0402FR-071KL-Yageo-datasheet-8329306.pdf?src-supplier=element14; ComponentLink12Description: https://datasheet.octopart.com:443/RC0402FR-071KL-Yageo-datasheet-8329306.pdf?src-supplier=element14; ComponentLink13URL: https://datasheet.octopart.com:443/RC0402FR-071KL-Yageo-datasheet-505231.pdf?src-supplier=element14; ComponentLink13Description: https://datasheet.octopart.com:443/RC0402FR-071KL-Yageo-datasheet-505231.pdf?src-supplier=element14; ComponentLink14URL: https://datasheet.octopart.com:443/RC0402FR-071KL-Yageo-datasheet-175423674.pdf?src-supplier=SOS+electronic; ComponentLink14Description: https://datasheet.octopart.com:443/RC0402FR-071KL-Yageo-datasheet-175423674.pdf?src-supplier=SOS+electronic; ComponentLink15URL: https://datasheet.octopart.com:443/RC0402FR-071KL-Yageo-datasheet-148775077.pdf?src-supplier=TME; ComponentLink15Description: https://datasheet.octopart.com:443/RC0402FR-071KL-Yageo-datasheet-148775077.pdf?src-supplier=TME; ComponentLink16URL: https://datasheet.octopart.com:443/RC0402FR-071KL-Yageo-datasheet-79472498.pdf?src-supplier=Megastar; ComponentLink16Description: https://datasheet.octopart.com:443/RC0402FR-071KL-Yageo-datasheet-79472498.pdf?src-supplier=Megastar; ComponentLink17URL: https://datasheet.octopart.com/RC0402FR-071KL-Yageo-datasheet-73766026.pdf; ComponentLink17Description: https://datasheet.octopart.com/RC0402FR-071KL-Yageo-datasheet-73766026.pdf; ComponentLink18URL: http://sigma.octopart.com:80/rohs_statement/Yageo-company-2.pdf?src-supplier=Compliance+Statements; ComponentLink18Description: http://sigma.octopart.com:80/rohs_statement/Yageo-company-2.pdf?src-supplier=Compliance+Statements; ComponentLink19URL: http://sigma.octopart.com:80/conflict_mineral_statement/Yageo-company-3.pdf?src-supplier=Compliance+Statements; ComponentLink19Description: http://sigma.octopart.com:80/conflict_mineral_statement/Yageo-company-3.pdf?src-supplier=Compliance+Statements
R28 R29 = CMP-04015-008529-1: 5.1kΩ ±1% 0.063W, 1/16W Chip Resistor 0402 (1005 Metric) Moisture Resistant Thin Film
U9 = USBLC6-2P6: Integrated Circuit; Manufacturer_Name: STMicroelectronics; Datasheet Link: https://datasheet.lcsc.com/szlcsc/STMicroelectronics-USBLC6-2P6_C15999.pdf; Height: 0.6mm; Manufacturer_Part_Number: USBLC6-2P6; Mouser Part Number: 511-USBLC6-2P6; Mouser Price/Stock: https://www.mouser.co.uk/ProductDetail/STMicroelectronics/USBLC6-2P6?qs=6ARB0lp6jlViGcbUSvj1Mw%3D%3D; Arrow Part Number: USBLC6-2P6; Arrow Price/Stock: https://www.arrow.com/en/products/usblc6-2p6/stmicroelectronics?utm_currency=USD&region=europe; LCSC Part #: C15999

## Sheet Stackup.SchDoc
size B; SheetNumber: 7; SheetTotal: 7
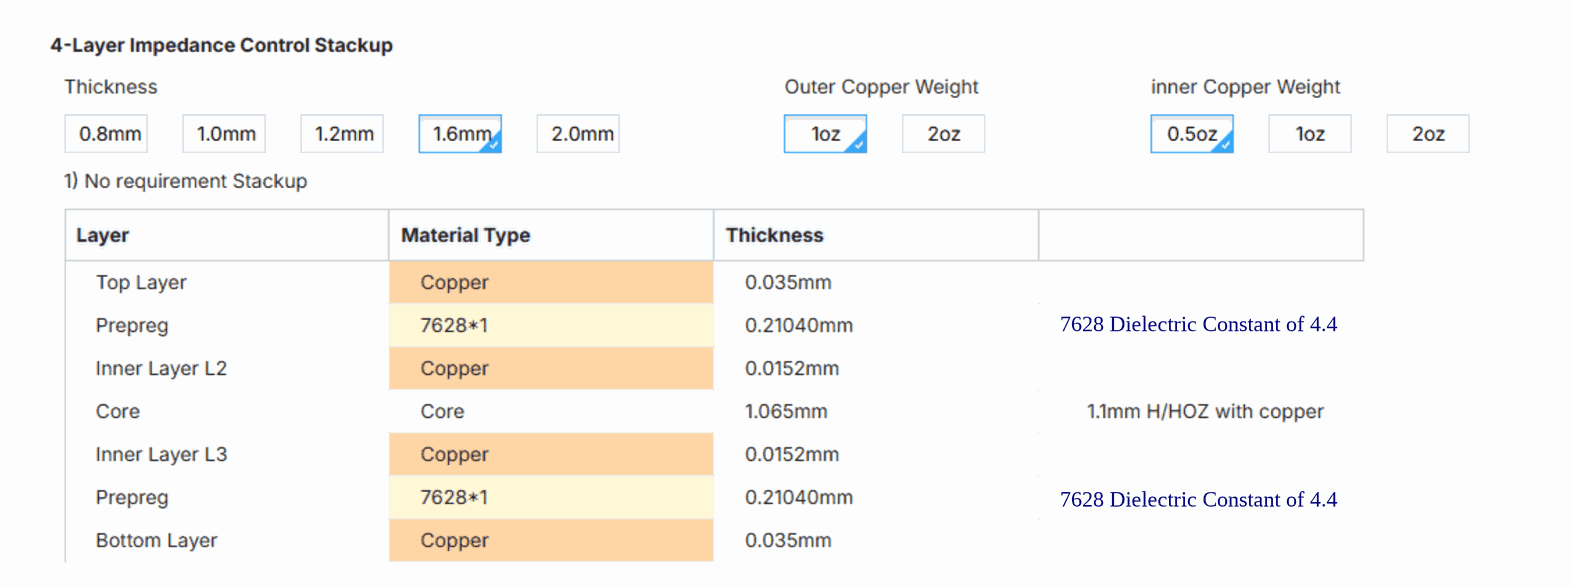
[diagram p3: Stackup.SchDoc]

### Notes on the sheet
- 7628 Dielectric Constant of 4.4

## Nets that join several sheets
3V3: MCU (5 pins), Power (C18.2 C19.2 U8.3), Connector (R8.2)
5V: Power (5 pins), Connector (D1.1 R7.2)
GND: MCU (8 pins), Power (15 pins), Connector (15 pins)
USB_D_N: MCU (U1.103), Connector (U9.6)
USB_D_P: MCU (U1.104), Connector (U9.4)